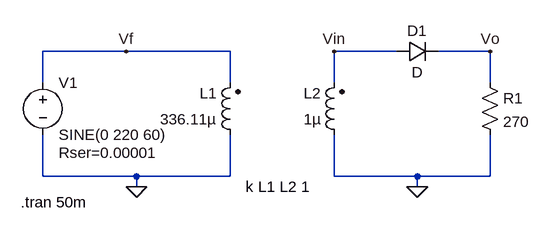
[diagram p0: schematic Parte_1a_semcapacitor.asc]
Parte_1a_semcapacitor.asc, the LTspice schematic file:
Version 4
SHEET 1 880 680
WIRE 176 80 48 80
WIRE 336 80 176 80
WIRE 592 80 496 80
WIRE 736 80 656 80
WIRE 48 128 48 80
WIRE 336 128 336 80
WIRE 496 128 496 80
WIRE 736 128 736 80
WIRE 48 272 48 208
WIRE 192 272 48 272
WIRE 336 272 336 208
WIRE 336 272 192 272
WIRE 496 272 496 208
WIRE 624 272 496 272
WIRE 736 272 736 208
WIRE 736 272 624 272
WIRE 192 288 192 272
WIRE 624 288 624 272
FLAG 192 288 0
FLAG 624 288 0
FLAG 176 80 Vf
FLAG 496 80 Vin
FLAG 736 80 Vo
SYMBOL voltage 48 112 R0
WINDOW 123 0 0 Left 0
WINDOW 39 24 124 Left 2
SYMATTR InstName V1
SYMATTR Value SINE(0 220 60)
SYMATTR SpiceLine Rser=0.00001
SYMBOL ind2 352 224 R180
WINDOW 0 36 80 Left 2
WINDOW 3 36 40 Left 2
SYMATTR InstName L1
SYMATTR Value 336.11µ
SYMATTR Type ind
SYMBOL ind2 512 224 R180
WINDOW 0 36 80 Left 2
WINDOW 3 36 40 Left 2
SYMATTR InstName L2
SYMATTR Value 1µ
SYMATTR Type ind
SYMBOL res 720 112 R0
SYMATTR InstName R1
SYMATTR Value 270
SYMBOL diode 592 96 R270
WINDOW 0 32 32 VTop 2
WINDOW 3 0 32 VBottom 2
SYMATTR InstName D1
TEXT 360 288 Left 2 !k L1 L2 1
TEXT 14 312 Left 2 !.tran 50m

The netlist it stands for:
* Parte_1a_semcapacitor.asc
V1 Vf 0 SINE(0 220 60) Rser=0.00001
L1 0 Vf 336.11µ
L2 0 Vin 1µ
R1 Vo 0 270
D1 Vin Vo D
.model D D
.lib standard.dio
k L1 L2 1
.tran 50m
.backanno
.end